# Altium schematic sheet Beacons.SchDoc
size A4; SheetNumber: 7; SheetTotal: 7; SPICEModelCachePBGWWJEJ: <root> / <DocumentId>PBGWWJEJ</DocumentId> / <CacheFrame Number="0"> / <Model Name="0805_150080gs75000" Kind="CKT"> / <Text>****** / .subckt 0805_150080GS75000  1  2 / D1 1 2 SMCW / .MODEL SMCW D / + IS=906.98E-12 / + N=4.4982 / + RS=1.5743 / + IKF=518.93E-9 / + CJO=1.0000E-12 / + M=.3333 / + VJ=.75 / + BV=5 / + IBV=10.00E-6 / + TT=5.0000E-9 / .ends</Text> / </Model> / <Model Name="0603_885012206071_100nf" Kind="CKT"> / <Text>******* / .subckt 0603_885012206071_100nF 1 2 / Rser 1 3 0.025 / Lser 2 4 0.0000000008 / C1 3 4 0.0000001 / Rpar 3 4 5000000000 / .ends 0603_885012206071_100nF</Text> / </Model> / <Model Name="0805_150080ys75000" Kind="CKT"> / <Text>****** / .subckt 0805_150080YS75000  1  2 / D1 1 2 SMCW / .MODEL SMCW D / + IS=10.000E-21 / + N=1.8000 / + RS=1.0003E-6 / + IKF=1.8092E-3 / + CJO=1.0000E-12 / + M=.3333 / + VJ=.75 / + BV=5 / + IBV=10.00E-6 / + TT=5.0000E-9 / .ends</Text> / </Model> / </CacheFrame> / </root>
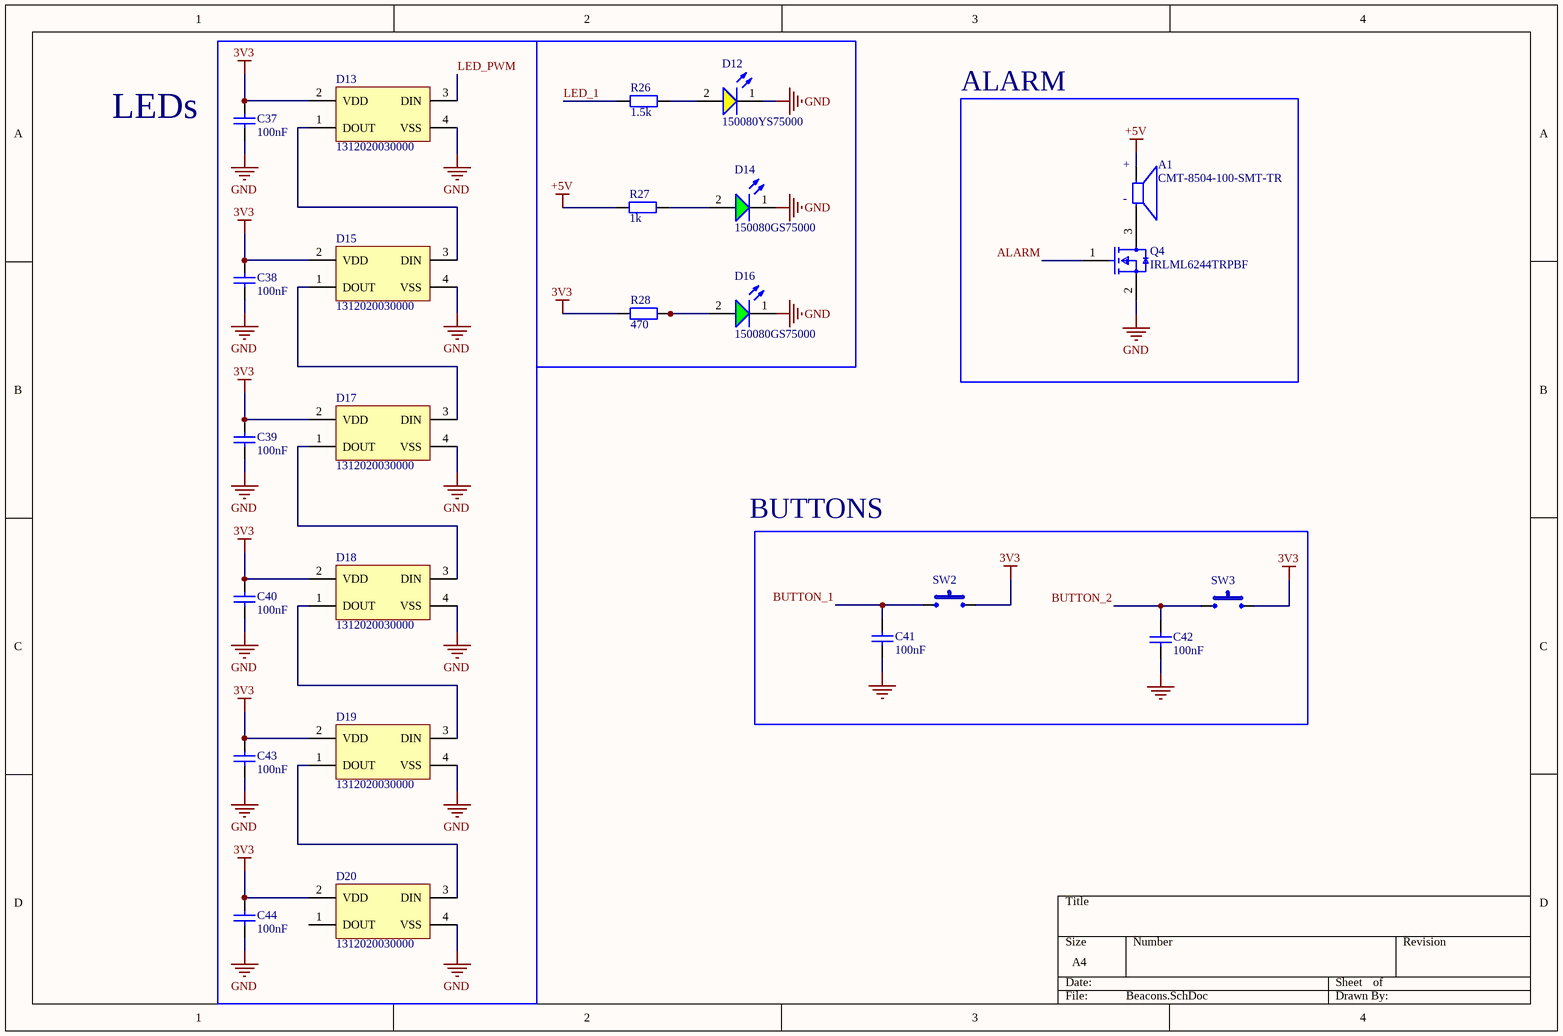
[diagram p0: Beacons.SchDoc]

## Parts
A1  CMT-8504-100-SMT-TR  [CMT-8504-100-SMT-TR-Footprint-1]
C37  value 100nF  [WCAP-CSGP_0603_L1.6W0.8H0.8_Reflow]  (hidden comment: 885012206071)
C38  value 100nF  [WCAP-CSGP_0603_L1.6W0.8H0.8_Reflow]  (hidden comment: 885012206071)
C39  value 100nF  [WCAP-CSGP_0603_L1.6W0.8H0.8_Reflow]  (hidden comment: 885012206071)
C40  value 100nF  [WCAP-CSGP_0603_L1.6W0.8H0.8_Reflow]  (hidden comment: 885012206071)
C41  value 100nF  [WCAP-CSGP_0603_L1.6W0.8H0.8_Reflow]  (hidden comment: 885012206071)
C42  value 100nF  [WCAP-CSGP_0603_L1.6W0.8H0.8_Reflow]  (hidden comment: 885012206071)
C43  value 100nF  [WCAP-CSGP_0603_L1.6W0.8H0.8_Reflow]  (hidden comment: 885012206071)
C44  value 100nF  [WCAP-CSGP_0603_L1.6W0.8H0.8_Reflow]  (hidden comment: 885012206071)
D12  150080YS75000  [WL-SMCW_0805_150080xx75000]
D13  1312020030000  [1312020030000]
D14  150080GS75000  [WL-SMCW_0805_150080xx75000]
D15  1312020030000  [1312020030000]
D16  150080GS75000  [WL-SMCW_0805_150080xx75000]
D17  1312020030000  [1312020030000]
D18  1312020030000  [1312020030000]
D19  1312020030000  [1312020030000]
D20  1312020030000  [1312020030000]
Q4  IRLML6244TRPBF  [FP-Micro3-IPC_C]
R26  value 1.5k  [WRIS-RSKS_0603_Reflow]  (hidden comment: 560112116038)
R27  value 1k  [WRIS-RSKS_0603_Reflow]  (hidden comment: 560112116014)
R28  value 470  [WRIS-RSKS_0603_Reflow]  (hidden comment: 560112116067)
SW2  PTS815SJM250SMTRLFS  [PTS815SJM250SMTRLFS-Footprint-1]  (value not drawn)
SW3  PTS815SJM250SMTRLFS  [PTS815SJM250SMTRLFS-Footprint-1]  (value not drawn)

## Blocks framed on the sheet
ALARM: A1 Q4

## Nets
3V3: C37.2 C38.2 C39.2 C40.2 C43.2 C44.2 D13.2(VDD) D15.2(VDD) D17.2(VDD) D18.2(VDD) D19.2(VDD) D20.2(VDD) R28.2 SW2.2 SW3.2
+5V: A1.P R27.1
GND: C37.1 C38.1 C39.1 C40.1 C41.1 C42.1 C43.1 C44.1 D12.1(K) D13.4(VSS) D14.1(K) D15.4(VSS) D16.1(K) D17.4(VSS) D18.4(VSS) D19.4(VSS) D20.4(VSS) Q4.2(S)
ALARM: Q4.1(G)
BUTTON_1: C41.2 SW2.1
BUTTON_2: C42.2 SW3.1
LED_1: R26.1
LED_PWM: D13.3(DIN)
NetA1_N: A1.N Q4.3(D)
NetD12_2: D12.2(A) R26.2
NetD13_1: D13.1(DOUT) D15.3(DIN)
NetD14_2: D14.2(A) R27.2
NetD15_1: D15.1(DOUT) D17.3(DIN)
NetD16_2: D16.2(A) R28.1
NetD17_1: D17.1(DOUT) D18.3(DIN)
NetD18_1: D18.1(DOUT) D19.3(DIN)
NetD19_1: D19.1(DOUT) D20.3(DIN)

Not connected (* = marked no-connect by the designer): D20 1(DOUT)

## Notes on the sheet
- LEDs
- BUTTONS
- (in symbol CMP-00027-00000-2) +; -

## Library data of the parts
A1 = CMP-00027-00000-2: Alarm
C37-C44 = CMP-001-00661-1: WCAP-CSGP Multilayer Ceramic Chip Capacitor, General Purpose, size 0603, X7R, 100nF, 25VDC; Manufacturer: Wurth Elektronik; Dissipation Factor: 3.5%; Capacitance Tolerance: +/-10%; Insulation Resistance: 5GOhm; Technical Reference: X7R0603104K025DFCT10000; Rated Voltage (DC): 25V; Packaging: Tape and Reel; Height: 0.8mm; Mount: Surface Mount; Source: WCAP-CSGP.SchLib; Component Type: Standard; Category: Multilayer Ceramic Chip Capacitors; Operating Temperature Min: -55°C; Case/Package: 0603; ComponentLink2Description: Datasheet Link; Width: 0.8mm; ComponentLink1URL: https://www.we-online.com/redexpert/article/885012206071?ad; Length: 1.6mm; Operating Temperature Max: 125°C; Match Code: WCAP-CSGP; ComponentLink2URL: https://www.we-online.com/redexpert/spec/885012206071?ad; Design Item ID: 885012206071; ComponentLink1Description: Website Link; Manufacturer Part Number: 885012206071; Pins: 2; Ceramic Type: X7R
D12 = CMP-004-00456-1: WL-SMCW Mono-color Chip LED Waterclear, SMT, size 0805, Yellow, 2V, 140°; Manufacturer: Wurth Elektronik; Chip Technology: AlInGaP; Peak Wavelength: 595nm; Luminous Intensity: 120mcd; Dominant Wavelength: 590nm; ComponentLink1URL: https://www.we-online.com/redexpert/article/150080YS75000?ad; Match Code: WL-SMCW; Design Item ID: 150080YS75000; ComponentLink2Description: Datasheet Link; Mount: Surface Mount; Emitting Color: Yellow; Pins: 2; Case/Package: 0805; Viewing Angle: 140°; Packaging: Tape and Reel; Width: 1.25mm; ComponentLink2URL: https://www.we-online.com/redexpert/spec/150080YS75000?ad; Length: 2mm; Forward Voltage: 2V; Source: WL-SMCW.SchLib; Operating Temperature Max: 85°C; Manufacturer Part Number: 150080YS75000; Component Type: Standard; Operating Temperature Min: -40°C; ComponentLink1Description: Website Link; Category: Signal LEDs; Height: 0.7mm
D13 D15 D17-D20 = CMP-004-00010-1: WL-ICLED Integrated Controller within LED, Chip LED 2020, 5.5mA; Manufacturer: Wurth Elektronik; Viewing Angle: 120°; Dominant Wavelength (Blue): 470nm; Luminous Intensity (Red): 80mcd; Peak Wavelength (Blue): 465nm; Luminous Intensity (Blue): 50mcd; Peak Wavelength (Red): 630nm; Peak Wavelength (Green): 520nm; Emitting Color: Green & Red & Blue; Frequency of the PWM: 5kHz; Luminous Intensity (Green): 120mcd; Dominant Wavelength (Red): 625nm; Dominant Wavelength (Green): 525nm; Operating Temperature Min: -40°C; Category: IC LEDs; Match Code: WL-ICLED; ComponentLink1URL: https://www.we-online.com/redexpert/article/1312020030000?ad; Design Item ID: 1312020030000; Width: 2mm; IC Output Current: 5.5mA; Case/Package: Chip LED 2020; Packaging: Tape and Reel; Source: WL-ICLED.SchLib; Pins: 4; Operating Temperature Max: 85°C; ComponentLink1Description: Website Link; Length: 2mm; ComponentLink2Description: Datasheet Link; Manufacturer Part Number: 1312020030000; Component Type: Standard; Height: 0.9mm; Mount: Surface Mount; ComponentLink2URL: https://www.we-online.com/redexpert/spec/1312020030000?ad
D14 = CMP-004-00452-1: WL-SMCW Mono-color Chip LED Waterclear, SMT, size 0805, Green, 3.2V, 140°; Manufacturer: Wurth Elektronik; Dominant Wavelength: 525nm; Chip Technology: InGaN; Luminous Intensity: 450mcd; Peak Wavelength: 515nm; Viewing Angle: 140°; Source: WL-SMCW.SchLib; Category: Signal LEDs; Design Item ID: 150080GS75000; ComponentLink1URL: https://www.we-online.com/redexpert/article/150080GS75000?ad; Pins: 2; Emitting Color: Green; Mount: Surface Mount; ComponentLink2URL: https://www.we-online.com/redexpert/spec/150080GS75000?ad; Match Code: WL-SMCW; ComponentLink1Description: Website Link; Operating Temperature Max: 85°C; Case/Package: 0805; Manufacturer Part Number: 150080GS75000; Forward Voltage: 3.2V; Operating Temperature Min: -40°C; Component Type: Standard; Height: 0.7mm; Length: 2mm; Width: 1.25mm; Packaging: Tape and Reel; ComponentLink2Description: Datasheet Link
D16 = CMP-1426-00007-3: WURTH ELEKTRONIK - 150080GS75000 - LED, Green, SMD, 0805, 30 mA, 3.2 V, 520 nm; Forward Voltage: 3.2V; Viewing Angle: 140°; Power Dissipation: 105mW; Peak Wavelength: 515nm; Max Reverse Voltage (DC): 5V; Luminous Intensity: 450mcd; Wavelength: 525nm; Max Junction Temperature (Tj): 95°C; Forward Current: 100mA; Test Current: 20mA; Lens Style: Clear, Rectangular; Length: 2mm; Case/Package: 0805; Case Code (Metric): 2012; Color: Green; Height: 700µm; Width: 1.25mm; Packaging: Tape and Reel; Mount: Surface Mount; REACH SVHC: Unknown; RoHS: Compliant; Min Operating Temperature: -40°C; Reverse Voltage: 5V; Max Operating Temperature: 85°C; Dominant Wavelength: 525nm; Case Code (Imperial): 0805
Q4 = CMP-013-00010-1: Power Field-Effect Transistor, 6.3A I(D), 20V, 0.021ohm, 1-Element, N-Channel, Silicon, Metal-oxide Semiconductor FET, TO-236AB; RoHS Compliant: Yes; Max Operating Temperature: 150°C; Pins: 3
R26 = CMP-009-00361-1: WRIS-RSKS Thick Film Resistor, size 0603, 1500Ohm, 100mW; Manufacturer: Wurth Elektronik; Temperature Coefficient of Resistance Max: 100ppm/°C; Temperature Coefficient of Resistance Min: -100ppm/°C; Limiting Element Voltage: 75V; Resistance Tolerance: +/-1%; Component Type: Standard; Pins: 2; Packaging: Tape and Reel; Design Item ID: 560112116038; Case/Package: 0603; Operating Temperature Max: 155°C; Length: 1.6mm; ComponentLink2URL: https://www.we-online.com/redexpert/spec/560112116038?ad; ComponentLink1Description: Website Link; Operating Temperature Min: -55°C; Source: WRIS-RSKS.SchLib; Height: 0.45mm; Rated Power: 100mW; Match Code: WRIS-RSKS; Mount: Surface Mount; Category: Thick Film Resistors; Manufacturer Part Number: 560112116038; ComponentLink1URL: https://www.we-online.com/redexpert/article/560112116038?ad; Width: 0.8mm; ComponentLink2Description: Datasheet Link
R27 = CMP-009-00337-1: WRIS-RSKS Thick Film Resistor, size 0603, 1000Ohm, 100mW; Manufacturer: Wurth Elektronik; Resistance Tolerance: +/-1%; Limiting Element Voltage: 75V; Temperature Coefficient of Resistance Min: -100ppm/°C; Temperature Coefficient of Resistance Max: 100ppm/°C; Mount: Surface Mount; Rated Power: 100mW; Packaging: Tape and Reel; Case/Package: 0603; ComponentLink1URL: https://www.we-online.com/redexpert/article/560112116014?ad; Height: 0.45mm; Manufacturer Part Number: 560112116014; ComponentLink1Description: Website Link; ComponentLink2URL: https://www.we-online.com/redexpert/spec/560112116014?ad; Source: WRIS-RSKS.SchLib; Operating Temperature Min: -55°C; Width: 0.8mm; Match Code: WRIS-RSKS; Design Item ID: 560112116014; ComponentLink2Description: Datasheet Link; Category: Thick Film Resistors; Operating Temperature Max: 155°C; Component Type: Standard; Length: 1.6mm; Pins: 2
R28 = CMP-009-00390-1: WRIS-RSKS Thick Film Resistor, size 0603, 470Ohm, 100mW; Manufacturer: Wurth Elektronik; Limiting Element Voltage: 75V; Temperature Coefficient of Resistance Max: 100ppm/°C; Resistance Tolerance: +/-1%; Temperature Coefficient of Resistance Min: -100ppm/°C; Rated Power: 100mW; Height: 0.45mm; ComponentLink2Description: Datasheet Link; Component Type: Standard; ComponentLink1URL: https://www.we-online.com/redexpert/article/560112116067?ad; ComponentLink1Description: Website Link; Operating Temperature Min: -55°C; Match Code: WRIS-RSKS; Mount: Surface Mount; Case/Package: 0603; Source: WRIS-RSKS.SchLib; Length: 1.6mm; Category: Thick Film Resistors; Operating Temperature Max: 155°C; Pins: 2; Packaging: Tape and Reel; Manufacturer Part Number: 560112116067; ComponentLink2URL: https://www.we-online.com/redexpert/spec/560112116067?ad; Width: 0.8mm; Design Item ID: 560112116067
SW2 SW3 = CMP-011-00002-1: Keypad Switch, 1 Switches, SPST, Momentary-tactile, 0.05A, 12VDC, 2.26N, Solder Terminal, Surface Mount-straight